# EAGLE design powerBoard (EAGLE 9.4.2)
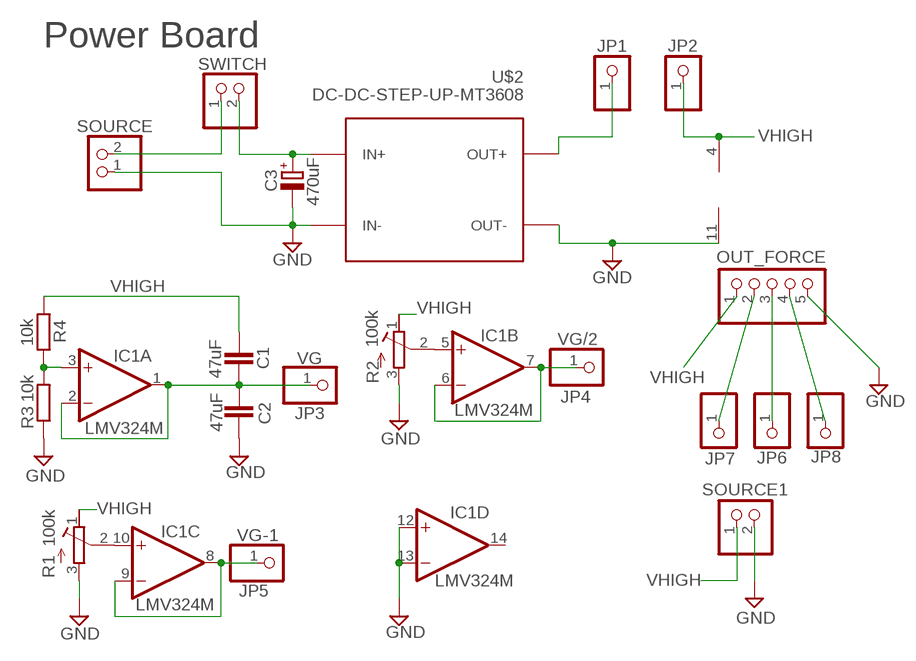
[diagram p0: schematic, sheet 1]

## Parts
C1  47uF  C-EUC0805  [C0805]
C2  47uF  C-EUC0805  [C0805]
C3  470uF  CPOL-EUE2.5-7  [E2,5-7]
IC1  LMV324M  [SO14]
JP1  PINHD-1X1  [1X01]
JP2  PINHD-1X1  [1X01]
JP3  PINHD-1X1  [1X01]
JP4  PINHD-1X1  [1X01]
JP5  PINHD-1X1  [1X01]
JP6  PINHD-1X1  [1X01]
JP7  PINHD-1X1  [1X01]
JP8  PINHD-1X1  [1X01]
OUT_FORCE  PINHD-1X5  [1X05]
R1  100k  R-TRIMM3006P  [RTRIM3006P]
R2  100k  R-TRIMM3006P  [RTRIM3006P]
R3  10k  R-EU_R0805  [R0805]
R4  10k  R-EU_R0805  [R0805]
SOURCE  PINHD-1X2  [1X02]
SOURCE1  PINHD-1X2  [1X02]
SWITCH  PINHD-1X2  [1X02]
U$2  DC-DC-STEP-UP-MT3608  [DC-DC-STEP-UP-MT3608]

## Nets
GND: C2.2 C3.- IC1.11(P:V-) IC1.12(D:+IN) IC1.13(D:-IN) OUT_FORCE.5 R1.3(A) R2.3(A) R3.1 SOURCE1.2 SOURCE.1 U$2.IN- U$2.OUT-
N$1: JP1.1 U$2.OUT+
N$2: IC1.3(A:+IN) R3.2 R4.2
N$3: SOURCE.2 SWITCH.1
N$4: C3.+ SWITCH.2 U$2.IN+
N$5: IC1.5(B:+IN) R2.2(S)
N$6: IC1.10(C:+IN) R1.2(S)
N$7: JP8.1 OUT_FORCE.4
N$8: JP6.1 OUT_FORCE.3
N$9: JP7.1 OUT_FORCE.2
VG: C1.2 C2.1 IC1.1(A:OUT) IC1.2(A:-IN) JP3.1
VG-1: IC1.8(C:OUT) IC1.9(C:-IN) JP5.1
VG/2: IC1.6(B:-IN) IC1.7(B:OUT) JP4.1
VHIGH: C1.1 IC1.4(P:V+) JP2.1 OUT_FORCE.1 R1.1(E) R2.1(E) R4.1 SOURCE1.1
Unconnected: IC1.14(D:OUT)

## Notes on the sheet
- Power Board

## Library data of the parts
C1 C2 = rcl:C-EU: CAPACITOR, European symbol; SPICEPREFIX: C
C3 = rcl:CPOL-EU: POLARIZED CAPACITOR, European symbol; SPICEPREFIX: C
IC1 = linear:LMV324?*: Quad General Purpose, Low Voltage, Rail-to-Rail Output Operational Amplifiers Source: http://www.national.com/mpf/LM/LMV321.html http://www.national.com/dt/lmv_qual.pdf
JP1-JP8 = pinhead:PINHD-1X1: PIN HEADER
OUT_FORCE = pinhead:PINHD-1X5: PIN HEADER
R1 R2 = rcl:R-TRIMM: Trimm resistor; SPICEMODEL: X; SPICEPREFIXL: POT
R3 R4 = rcl:R-EU_: RESISTOR, European symbol; SPICEPREFIX: R
SOURCE SOURCE1 SWITCH = pinhead:PINHD-1X2: PIN HEADER
U$2 = diy-modules_me2:DC-DC-STEP-UP-MT3608: DC/DC Step-Up Regulator based on MT3608 chip MT3608 datasheet available here: https://www.olimex.com/Products/Breadboarding/BB-PWR-3608/resources/MT3608.pdf Click here to find device on ebay.com <http://www.ebay.com/sch/mt3608+module>

## Board
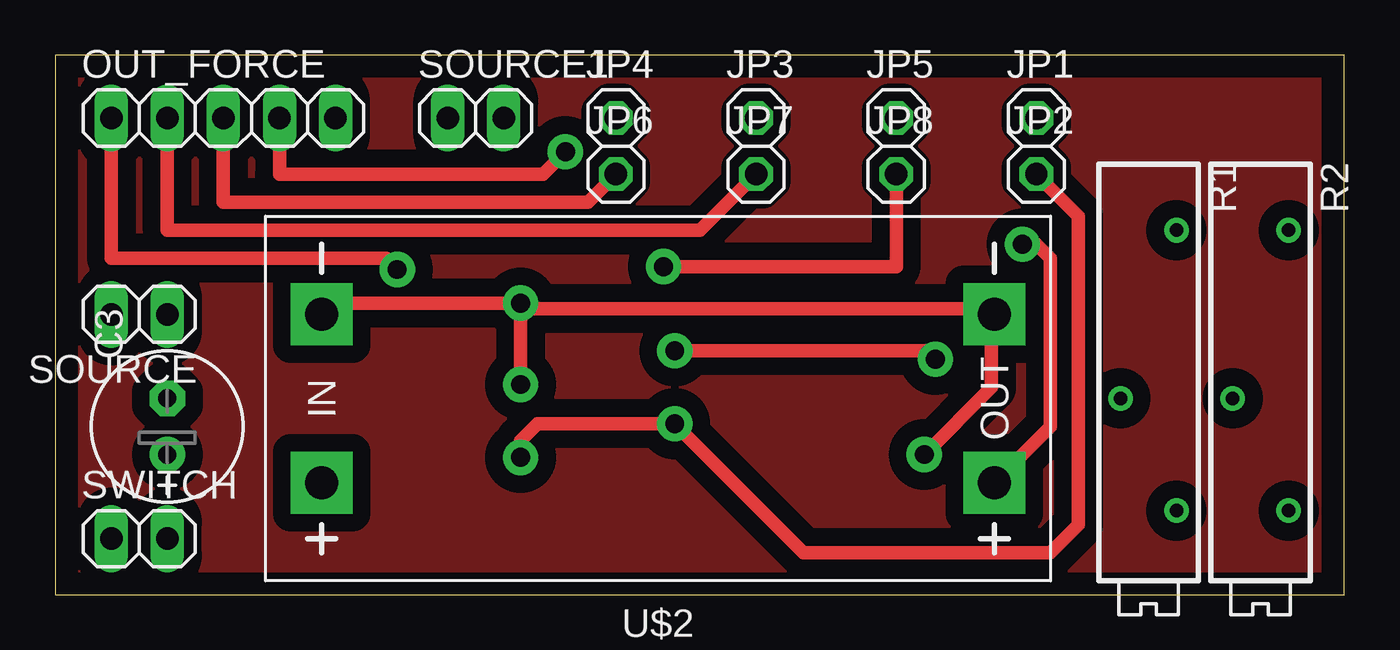
[diagram p1: board, top side]
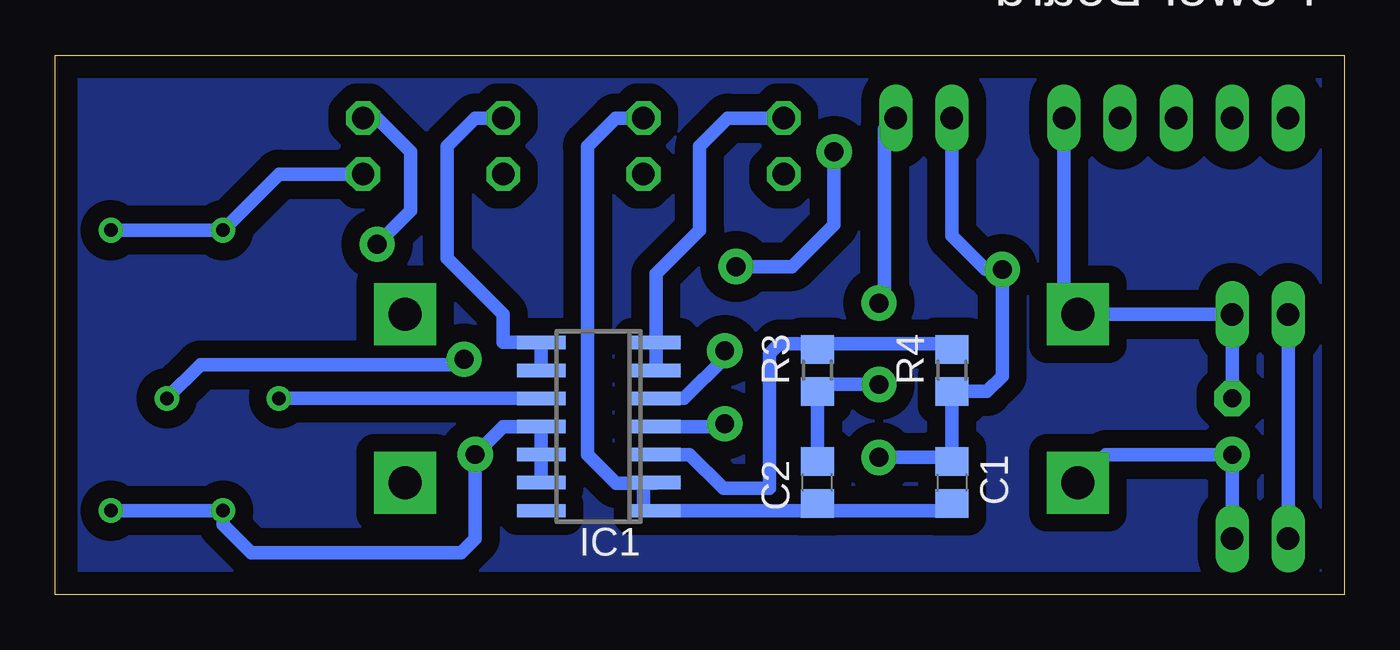
[diagram p2: board, bottom side, seen from below]

Size 58.4 x 24.43 mm. Coordinates in mm from the lower left corner, seen from the top.
Outline: 0,0 58.4,0 58.4,24.43 0,24.43 0,0
Copper layers (1*16): Top 0.035mm / dielectric 1.5mm / Bottom 0.035mm
Design rules "default": minimum track width 6mil, minimum drill 0.35mm, track to track 6mil, track to pad 6mil, pad to pad 6mil, via to via 6mil, smd to smd 6mil, copper to edge 40mil, drill to drill 6mil, minimum pad ring 10mil, minimum via ring 8mil, stop-mask expansion 4mil, vias tented up to drill 0mil, thermal gap 10mil

### Footprints (pad centres in the part's own frame; a part is rotated, then mirrored left to right if it is on the bottom)
C0805 = smd 1.3 x 1.5: 1 -0.95,0; 2 0.95,0
E2,5-7 = drill 0.813 pad 1.6: + -1.27,0 | drill 0.813 pad 1.6 octagon: - 1.27,0
SO14 = smd 0.6 x 2.2: 1 -3.81,-2.6; 2 -2.54,-2.6; 3 -1.27,-2.6; 4 0,-2.6; 5 1.27,-2.6; 6 2.54,-2.6; 7 3.81,-2.6; 8 3.81,2.6; 9 2.54,2.6; 10 1.27,2.6; 11 0,2.6; 12 -1.27,2.6; 13 -2.54,2.6; 14 -3.81,2.6
1X01 = drill 1.016 octagon: 1 0,0
1X05 = drill 1.016 long: 1 -5.08,0; 2 -2.54,0; 3 0,0; 4 2.54,0; 5 5.08,0
RTRIM3006P = drill 0.61: 1 -7.62,1.27; 2 0,-1.27; 3 5.08,1.27
R0805 = smd 1.3 x 1.5: 1 -0.95,0; 2 0.95,0
1X02 = drill 1.016 long: 1 -1.27,0; 2 1.27,0
DC-DC-STEP-UP-MT3608 = drill 1.5 pad 2.8 square: IN+ 15.24,3.81; IN- 15.24,-3.81; OUT+ -15.24,3.81; OUT- -15.24,-3.81

### Placement (x,y rotation side)
C1  17.78,5.08 270 bottom
C2  23.88,5.08 90 bottom
C3  5.08,7.62 90 top
IC1  33.78,7.62 90 bottom
JP1  44.45,21.59 0 top
JP2  44.45,19.05 0 top
JP3  31.75,21.59 0 top
JP4  25.4,21.59 0 top
JP5  38.1,21.59 0 top
JP6  25.4,19.05 0 top
JP7  31.75,19.05 0 top
JP8  38.1,19.05 0 top
OUT_FORCE  7.62,21.59 0 top
R1  49.53,8.89 270 top
R2  54.61,8.89 270 top
R3  23.88,10.16 90 bottom
R4  17.78,10.16 90 bottom
SOURCE  3.81,12.7 180 top
SOURCE1  19.05,21.59 0 top
SWITCH  3.81,2.54 0 top
U$2  27.3,8.89 180 top

### Tracks (layer width: path | path; a pad name or v marks a point on that pad's centre or on a via)
BOT
  pour Bottom (isolate 0.8): 0,24.38 0,0 58.42,0 58.42,24.38
GND  (via drill 0.85 pad 1.6)
  Top 0.61: v21.08,13.21 v21.08,9.53 | v39.37,6.35 42.42,9.4 42.42,12.57 U$2.OUT- 42.29,12.95 21.34,12.95 v21.08,13.21 | U$2.IN- 12.57,13.21 v21.08,13.21
  Bottom 0.61: C2.2 R3.1 23.56,9.53 v21.08,9.53 | IC1.13 IC1.12 IC1.11 38.1,7.62 v39.37,6.35 39.37,2.54 40.01,1.91 49.53,1.91 50.8,3.17 R1.3 R2.3 | SOURCE1.2 20.83,21.08 20.83,13.46 v21.08,13.21 | OUT_FORCE.5 12.7,13.34 U$2.IN- SOURCE.1 C3.-
N$1  (via drill 0.85 pad 1.6)
  Top 0.61: v43.81,15.88 44.45,15.88 45.09,15.24 45.09,7.62 U$2.OUT+
  Bottom 0.61: v43.81,15.88 42.29,17.4 42.29,20.07 43.81,21.59 JP1.1
N$2
  Bottom 0.61: R4.2 18.03,11.36 23.62,11.36 R3.2 24.13,11.36 25.59,11.36 26.04,10.92 26.04,4.83 28.13,4.83 29.66,6.35 IC1.3
N$3
  Bottom 0.61: SOURCE.2 SWITCH.1
N$4
  Bottom 0.61: SWITCH.2 C3.+ 10.79,6.35 U$2.IN+
N$5  (via drill 0.85 pad 1.6)
  Top 0.61: v39.88,10.67 39.5,11.05 v28.07,11.05
  Bottom 0.61: IC1.5 29.91,8.89 28.07,10.73 v28.07,11.05 | R2.2 51.82,10.41 39.88,10.41 v39.88,10.67
N$6
  Bottom 0.61: IC1.10 R1.2
N$7  (via drill 0.85 pad 1.6)
  Top 0.61: OUT_FORCE.4 10.16,19.05 22.1,19.05 v23.11,20.07 | v27.56,14.86 38.1,14.86 JP8.1
  Bottom 0.61: v27.56,14.86 25.02,14.86 23.11,16.76 v23.11,20.07
N$8
  Top 0.61: OUT_FORCE.3 7.62,17.78 24.13,17.78 JP6.1
N$9
  Top 0.61: JP7.1 29.21,16.51 5.08,16.51 OUT_FORCE.2
TOP
  pour Top (isolate 0.8): 0,24.38 0,0 58.42,0 58.42,24.38
VG
  Bottom 0.61: C1.2 18.1,3.81 24.2,3.81 | 31.72,5.05 31.75,5.02 31.75,3.81 IC1.1 24.2,3.81 | IC1.2 31.21,5.05 31.72,5.05 | JP3.1 33.02,21.59 34.29,20.32 34.29,6.35 32.99,5.05 31.72,5.05 | C2.1 24.2,3.81
VG-1
  Bottom 0.61: IC1.9 IC1.8 38.1,11.43 38.1,12.7 40.64,15.24 40.64,20.32 39.37,21.59 JP5.1
VG/2
  Bottom 0.61: IC1.6 IC1.7 31.18,14.54 29.21,16.51 29.21,20.32 27.94,21.59 JP4.1
VHIGH  (via drill 0.85 pad 1.6)
  Top 0.61: OUT_FORCE.1 2.54,15.24 14.99,15.24 v15.49,14.73 | v21.08,6.22 21.08,6.99 21.84,7.75 v28.07,7.75 33.91,1.91 45.09,1.91 46.35,3.17 46.35,17.14 JP2.1
  Bottom 0.61: v21.08,6.22 17.97,6.22 C1.1 R4.1 16.19,9.21 15.49,9.91 v15.49,14.73 16.26,14.73 17.78,16.26 SOURCE1.1 | v28.07,7.75 28.07,7.62 IC1.4 | JP2.1 48.26,19.05 R1.1 R2.1

### Text on the board
bPlace: Power Board